# Altium project as14120_x31.PrjPCB (part 3 of 3)

## Sheet as14120_x31_adc.SchDoc
size A3; PageSetup: Record=PageOptions|CenterHorizontal=True|CenterVertical=True|PrintScale=1.11|XCorrection=1.00|YCorrection=1.00|PrintKind=0|BorderSize=5000000|LeftOffset=0|BottomOffset=0|Orientation=2|PaperLength=1000|PaperWidth=1000|Scale=100|PaperSource=7|PrintQuality=-4|MediaType=1|DitherType=10|PaperKind=A4 (210 x 297 мм)|PrintScaleMode=1
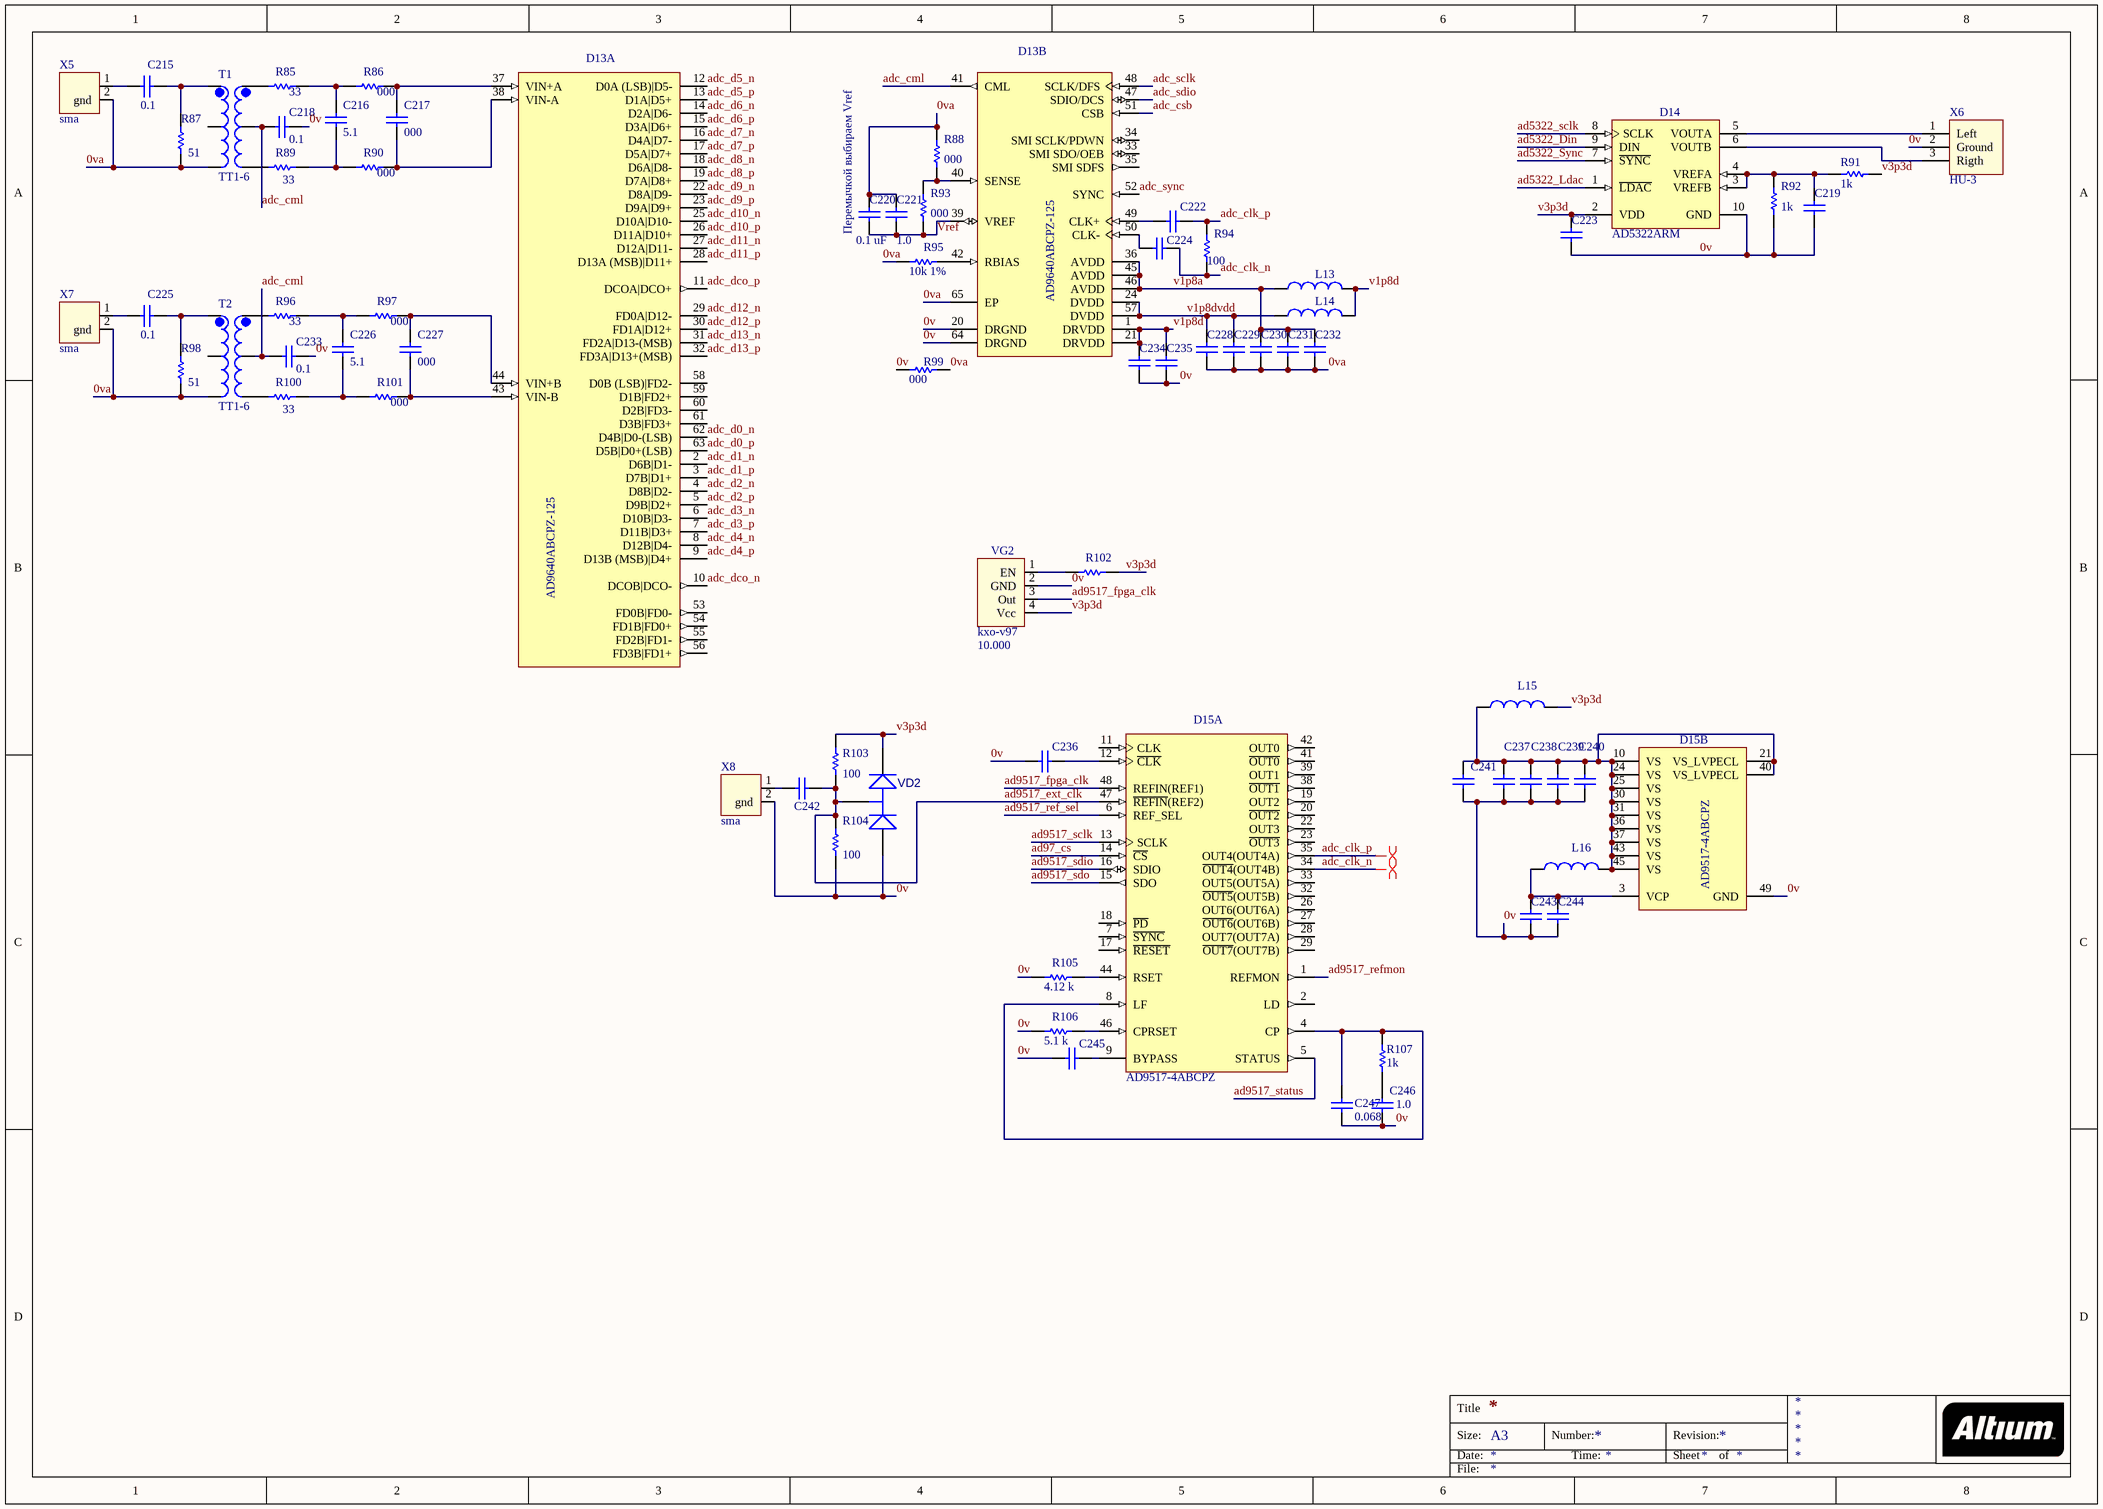
[diagram p7: as14120_x31_adc.SchDoc]

### Parts
C215  value 0.1  [CAPC0402(1005)60_M]  (hidden comment: CAP 1uF 10V 0402(1005))
C216  value 5.1  [CAPC0805(2012)100_N]  (hidden comment: CAP_0805)
C217  value 000  [CAPC0805(2012)100_N]  (hidden comment: CAP_0805)
C218  value 0.1  [CAPC0402(1005)60_M]  (hidden comment: CAP 1uF 10V 0402(1005))
C219  CAP 1uF 10V 0402(1005)  [CAPC0402(1005)60_M]  (value not drawn)
C220  value 0.1 uF  [CAPC0402(1005)60_M]  (hidden comment: CAP 1uF 10V 0402(1005))
C221  value 1.0  [CAPC0402(1005)60_M]  (hidden comment: CAP 1uF 10V 0402(1005))
C222  CAP 1uF 10V 0402(1005)  [CAPC0402(1005)60_M]  (value not drawn)
C223  CAP 1uF 10V 0402(1005)  [CAPC0402(1005)60_M]  (value not drawn)
C224  CAP 1uF 10V 0402(1005)  [CAPC0402(1005)60_M]  (value not drawn)
C225  value 0.1  [CAPC0402(1005)60_M]  (hidden comment: CAP 1uF 10V 0402(1005))
C226  value 5.1  [CAPC0805(2012)100_N]  (hidden comment: CAP_0805)
C227  value 000  [CAPC0805(2012)100_N]  (hidden comment: CAP_0805)
C228  CAP 1uF 10V 0402(1005)  [CAPC0402(1005)60_M]  (value not drawn)
C229  CAP 1uF 10V 0402(1005)  [CAPC0402(1005)60_M]  (value not drawn)
C230  CAP 1uF 10V 0402(1005)  [CAPC0402(1005)60_M]  (value not drawn)
C231  CAP 1uF 10V 0402(1005)  [CAPC0402(1005)60_M]  (value not drawn)
C232  CAP 1uF 10V 0402(1005)  [CAPC0402(1005)60_M]  (value not drawn)
C233  value 0.1  [CAPC0402(1005)60_M]  (hidden comment: CAP 1uF 10V 0402(1005))
C234  CAP 1uF 10V 0402(1005)  [CAPC0402(1005)60_M]  (value not drawn)
C235  CAP 1uF 10V 0402(1005)  [CAPC0402(1005)60_M]  (value not drawn)
C236  CAP 1uF 10V 0402(1005)  [CAPC0402(1005)60_M]  (value not drawn)
C237  CAP 1uF 10V 0402(1005)  [CAPC0402(1005)60_M]  (value not drawn)
C238  CAP 1uF 10V 0402(1005)  [CAPC0402(1005)60_M]  (value not drawn)
C239  CAP 1uF 10V 0402(1005)  [CAPC0402(1005)60_M]  (value not drawn)
C240  CAP 1uF 10V 0402(1005)  [CAPC0402(1005)60_M]  (value not drawn)
C241  CAP 1uF 10V 0402(1005)  [CAPC0402(1005)60_M]  (value not drawn)
C242  CAP 1uF 10V 0402(1005)  [CAPC0402(1005)60_M]  (value not drawn)
C243  CAP 1uF 10V 0402(1005)  [CAPC0402(1005)60_M]  (value not drawn)
C244  CAP 1uF 10V 0402(1005)  [CAPC0402(1005)60_M]  (value not drawn)
C245  CAP 1uF 10V 0402(1005)  [CAPC0402(1005)60_M]  (value not drawn)
C246  value 1.0  [CAPC0805(2012)100_N]  (hidden comment: CAP_0805)
C247  value 0.068  [CAPC0805(2012)100_N]  (hidden comment: CAP_0805)
D13  AD9640ABCPZ-125  [CP-64-6_N]  (parts A,B of 2)
D14  AD5322ARM  [RM-10_L]
D15  AD9517-4ABCPZ  [ADI-CP-48-8_L]  (parts A,B of 2)
L13  BLM21PG300SN1D  [CAPC0805(2012)100_N]  (value not drawn)
L14  BLM21PG300SN1D  [CAPC0805(2012)100_N]  (value not drawn)
L15  BLM21PG300SN1D  [CAPC0805(2012)100_N]  (value not drawn)
L16  BLM21PG300SN1D  [CAPC0805(2012)100_N]  (value not drawn)
R85  value 33  [RESC0805(2012)_L]  (hidden comment: 1K 1% 0805(2012))
R86  value 000  [RESC0805(2012)_L]  (hidden comment: 1K 1% 0805(2012))
R87  value 51  [RESC0805(2012)_L]  (hidden comment: 1K 1% 0805(2012))
R88  value 000  [RESC0603(1608)_L]  (hidden comment: 1K 5% 0603(1608))
R89  value 33  [RESC0805(2012)_L]  (hidden comment: 1K 1% 0805(2012))
R90  value 000  [RESC0805(2012)_L]  (hidden comment: 1K 1% 0805(2012))
R91  1k  [RESC0603(1608)_L]
R92  1k  [RESC0603(1608)_L]
R93  value 000  [RESC0603(1608)_L]  (hidden comment: 1K 5% 0603(1608))
R94  100  [RESC0805(2012)_L]
R95  10k 1%  [RESC0805(2012)_L]
R96  value 33  [RESC0805(2012)_L]  (hidden comment: 1K 1% 0805(2012))
R97  value 000  [RESC0805(2012)_L]  (hidden comment: 1K 1% 0805(2012))
R98  value 51  [RESC0805(2012)_L]  (hidden comment: 1K 1% 0805(2012))
R99  000  [RESC0603(1608)_L]
R100  value 33  [RESC0805(2012)_L]  (hidden comment: 1K 1% 0805(2012))
R101  value 000  [RESC0805(2012)_L]  (hidden comment: 1K 1% 0805(2012))
R102  1K 5% 0603(1608)  [RESC0603(1608)_L]  (value not drawn)
R103  value 100  [RESC0805(2012)_L]  (hidden comment: 1K 1% 0805(2012))
R104  value 100  [RESC0805(2012)_L]  (hidden comment: 1K 1% 0805(2012))
R105  value 4.12 k  [RESC0805(2012)_L]  (hidden comment: 1K 1% 0805(2012))
R106  value 5.1 k  [RESC0805(2012)_L]  (hidden comment: 1K 1% 0805(2012))
R107  value 1k  [RESC0805(2012)_L]  (hidden comment: 1K 1% 0805(2012))
T1  TT1-6  [TT!-6-KK81]
T2  TT1-6  [TT!-6-KK81]
VD2  BAV99  [SO-G3/X.9]  (value not drawn)
VG2  kxo-v97  value 10.000  [kxo-v97]
X5  sma  [sma]
X6  HU-3  [HU-3]
X7  sma  [sma]
X8  sma  [sma]

### Nets
0v: C218.2 C219.1 C223.1 C233.2 C234.1 C235.1 C236.1 C237.1 C238.1 C239.1 C240.1 C241.1 C243.1 C244.1 C245.1 C246.1 C247.1 D13.20(DRGND) D13.64(DRGND) D14.10(GND) D15.49(GND) R92.2 R99.1 R104.1 R105.2 R106.2 VD2.3(A) VG2.2(GND) X6.2(Ground) X8.2(gnd)
0va: C220.2 C221.2 C228.1 C229.1 C230.1 C231.1 C232.1 D13.65(EP) R87.1 R88.1 R95.2 R98.1 R99.2 T1.6 T2.6 X5.2(gnd) X7.2(gnd)
ad97_cs: D15.14(~{CS})
AD5322_DIN: D14.9(DIN)
AD5322_LDAC: D14.1(~{LDAC})
AD5322_SCLK: D14.8(SCLK)
AD5322_SYNC: D14.7(~{SYNC})
ad9517_ext_clk: C242.2 D15.47(~{REFIN}(REF2)) R103.1 R104.2 VD2.1(C)
ad9517_fpga_clk: D15.48(REFIN(REF1)) VG2.3(Out)
ad9517_ref_sel: D15.6(REF_SEL)
ad9517_refmon: D15.1(REFMON)
ad9517_sclk: D15.13(SCLK)
ad9517_sdio: D15.16(SDIO)
ad9517_sdo: D15.15(SDO)
ad9517_status: D15.5(STATUS)
adc_clk_n: C224.1 D15.34(~{OUT4}(OUT4B)) R94.1
adc_clk_p: C222.1 D15.35(OUT4(OUT4A)) R94.2
adc_cml: C218.1 C233.1 D13.41(CML) T1.2 T2.2
adc_csb: D13.51(CSB)
adc_d0_n: D13.62(D4B|D0-(LSB))
adc_d0_p: D13.63(D5B|D0+(LSB))
adc_d1_n: D13.2(D6B|D1-)
adc_d1_p: D13.3(D7B|D1+)
adc_d2_n: D13.4(D8B|D2-)
adc_d2_p: D13.5(D9B|D2+)
adc_d3_n: D13.6(D10B|D3-)
adc_d3_p: D13.7(D11B|D3+)
adc_d4_n: D13.8(D12B|D4-)
adc_d4_p: D13.9(D13B_(MSB)|D4+)
adc_d5_n: D13.12(D0A_(LSB)|D5-)
adc_d5_p: D13.13(D1A|D5+)
adc_d6_n: D13.14(D2A|D6-)
adc_d6_p: D13.15(D3A|D6+)
adc_d7_n: D13.16(D4A|D7-)
adc_d7_p: D13.17(D5A|D7+)
adc_d8_n: D13.18(D6A|D8-)
adc_d8_p: D13.19(D7A|D8+)
adc_d9_n: D13.22(D8A|D9-)
adc_d9_p: D13.23(D9A|D9+)
adc_d10_n: D13.25(D10A|D10-)
adc_d10_p: D13.26(D11A|D10+)
adc_d11_n: D13.27(D12A|D11-)
adc_d11_p: D13.28(D13A_(MSB)|D11+)
adc_d12_n: D13.29(FD0A|D12-)
adc_d12_p: D13.30(FD1A|D12+)
adc_d13_n: D13.31(FD2A|D13-(MSB))
adc_d13_p: D13.32(FD3A|D13+(MSB))
adc_dco_n: D13.10(DCOB|DCO-)
adc_dco_p: D13.11(DCOA|DCO+)
adc_sclk: D13.48(SCLK/DFS)
adc_sdio: D13.47(SDIO/DCS)
adc_sync: D13.52(SYNC)
v1p8a: C230.2 C231.2 C232.2 D13.36(AVDD) D13.45(AVDD) D13.46(AVDD) L13.1
v1p8d: C234.2 C235.2 D13.1(DRVDD) D13.21(DRVDD) L13.2 L14.2
v1p8dvdd: C228.2 C229.2 D13.24(DVDD) D13.57(DVDD) L14.1
v3p3d: C223.2 D14.2(VDD) L15.2 R91.2 R102.1 R103.2 VD2.2(K) VG2.4(Vcc)
Vref: C220.1 C221.1 D13.39(VREF) R93.2
NetC215_1: C215.1 X5.1
NetC215_2: C215.2 R87.2 T1.4
NetC216_1: C216.1 R89.1 R90.2
NetC216_2: C216.2 R85.1 R86.2
NetC217_1: C217.1 D13.38(VIN-A) R90.1
NetC217_2: C217.2 D13.37(VIN+A) R86.1
NetC219_2: C219.2 D14.3(VREFB) D14.4(VREFA) R91.1 R92.1
NetC222_2: C222.2 D13.49(CLK+)
NetC224_2: C224.2 D13.50(CLK-)
NetC225_1: C225.1 X7.1
NetC225_2: C225.2 R98.2 T2.4
NetC226_1: C226.1 R100.1 R101.2
NetC226_2: C226.2 R96.1 R97.2
NetC227_1: C227.1 D13.43(VIN-B) R101.1
NetC227_2: C227.2 D13.44(VIN+B) R97.1
NetC236_2: C236.2 D15.12(~{CLK})
NetC237_2: C237.2 C238.2 C239.2 C240.2 C241.2 D15.10(VS) D15.21(VS_LVPECL) D15.24(VS) D15.25(VS) D15.30(VS) D15.31(VS) D15.36(VS) D15.37(VS) D15.40(VS_LVPECL) D15.43(VS) D15.45(VS) L15.1 L16.2
NetC242_1: C242.1 X8.1
NetC243_2: C243.2 C244.2 D15.3(VCP) L16.1
NetC245_2: C245.2 D15.9(BYPASS)
NetC246_2: C246.2 R107.2
NetC247_2: C247.2 D15.4(CP) D15.8(LF) R107.1
NetD13_40: D13.40(SENSE) R88.2 R93.1
NetD13_42: D13.42(RBIAS) R95.1
NetD14_5: D14.5(VOUTA) X6.1(Left)
NetD14_6: D14.6(VOUTB) X6.3(Rigth)
NetD15_44: D15.44(RSET) R105.1
NetD15_46: D15.46(CPRSET) R106.1
NetR85_2: R85.2 T1.3
NetR89_2: R89.2 T1.1
NetR96_2: R96.2 T2.3
NetR100_2: R100.2 T2.1
NetR102_2: R102.2 VG2.1(EN)

Not connected (* = marked no-connect by the designer): D13 33(SMI_SDO/OEB) 34(SMI_SCLK/PDWN) 35(SMI_SDFS) 53(FD0B|FD0-) 54(FD1B|FD0+) 55(FD2B|FD1-) 56(FD3B|FD1+) 58(D0B_(LSB)|FD2-) 59(D1B|FD2+) 60(D2B|FD3-) 61(D3B|FD3+); D15 2(LD) 7(~{SYNC}) 11(CLK) 17(~{RESET}) 18(~{PD}) 19(OUT2) 20(~{OUT2}) 22(OUT3) 23(~{OUT3}) 26(OUT6(OUT6A)) 27(~{OUT6}(OUT6B)) 28(OUT7(OUT7A)) 29(~{OUT7}(OUT7B)) 32(~{OUT5}(OUT5B)) 33(OUT5(OUT5A)) 38(~{OUT1}) 39(OUT1) 41(~{OUT0}) 42(OUT0); T1 5; T2 5

### Layout directives
differential pair: adc_clk_n, adc_clk_p

### Notes on the sheet
- (near C220) Перемычкой выбираем Vref
- Title
- Size:
- Date:
- A3
- Number:
- Time:
- Revision:
- Sheet
- of
- File:

### Library data of the parts
C215 C218 C220 C221 C225 C233 = CAP_0402: as C1-C38 on sheet as14120_x31_ddr; Tolerance: ±20%; Max Thickness: 0.6 mm; Rated Voltage: 10 V; Technology: SMT
C219 C222-C224 C228-C232 C234-C241 C243-C245 = CAP_0402: CAP 1uF 10V ±20% 0402 (1005 Metric) Thickness 0.6mm SMD; Case-Metric: 1005; Case-EIA: 0402; Value: 0.1 uF; Tolerance: ±20%; Max Thickness: 0.6 mm; Rated Voltage: 10 V; Technology: SMT
C242 = CAP_0402: CAP 1uF 10V ±20% 0402 (1005 Metric) Thickness 0.6mm SMD; Case-Metric: 1005; Case-EIA: 0402; Value: 0.01 uF; Tolerance: ±20%; Max Thickness: 0.6 mm; Rated Voltage: 10 V; Technology: SMT
D13 = AD9640ABCPZ-125: Dual 14-Bit Analog-to-Digital Converter with Parallel Interface, 1.8 V, 125MSPS, -40 to +85 degC, CP-64-6, Pb-Free, Tray; Part Number: AD9640-125; Manufacturer: Analog Devices; Resolution (Bits): 14; Channels: 2; Throughput Rate (SPS): 125M; Interface: Par; DatasheetVersion: Rev.B; PackageVersion: 041509-A; PackageReference: CP-64-6; PackageDescription: 64-Lead Lead Frame Chip Scale Package [LFCSP_VQ] 9 x 9 mm Body, Very Thin Quad; RoHS: Y; Packing: Tray; Mounting Technology: Surface Mount; Code_JEDEC: MO-220-VMMD-4; ComponentLink1Description: Manufacturer URL; ComponentLink1URL: http://www.analog.com/en/index.html; ComponentLink2Description: Datasheet; ComponentLink2URL: http://www.analog.com/static/imported-files/data_sheets/AD9640.pdf; ComponentLink3Description: Package Specification; ComponentLink3URL: http://www.analog.com/static/imported-files/packages/PKG_PDF/LFCSP(CP)/CP_64_6.pdf; ComponentLink4Description: Product URL; ComponentLink4URL: http://www.analog.com/en/analog-to-digital-converters/ad-converters/ad9640/products/product.html
D14 = AD5322ARM: Dual 12-Bit Rail-to-Rail Output Digital-to-Analog Converter, 2.5 to 5.5 V, -40 to +105 degC, RM-10, Tube; ADI Part Number: AD5322; Manufacturer: Analog Devices; # DAC Outputs: 2; Max V+: 5.5V; Op Pwr Diss: 2.5mW; Resolution (Bits): 12; Settling Time: 8µs; Single Supply: Yes; DatasheetVersion: Rev.D; PackageVersion: May-2005; PackageReference: RM-10; PackageDescription: 10-Lead Mini Small Outline Package [MSOP]; Packing: Tube; RoHS: N; Mounting Technology: Surface Mount; ComponentLink1Description: Manufacturer URL; ComponentLink1URL: http://www.analog.com/en/index.html; ComponentLink2Description: Datasheet; ComponentLink2URL: http://www.analog.com/static/imported-files/data_sheets/AD5302_5312_5322.pdf; ComponentLink3Description: Package Specification; ComponentLink3URL: http://www.analog.com/static/imported-files/packages/PKG_PDF/MSOP%28RM%29/RM_10.pdf; ComponentLink4Description: URL Link1; ComponentLink4URL: Product URL:http://www.analog.com/en/digital-to-analog-converters/da-converters/ad5322/products/product.html
D15 = AD9517-4ABCPZ: 12-Output Clock Generator with Integrated 2.5 GHz VCO, 1800 MHz Max f-out, CP-48-8, Pb-Free, 260 Tray; Product Description: Multi-Output Clock Generator; +Supply Voltage (V): 3.3; Inputs: 2; Outputs: 12; Dividers: 4; On-Chip VCO or DCO: Yes; Max f-out (MHz): 1800; Output Logic: CMOS; LVDS; LVPECL; DatasheetVersion: Rev.D; PackageVersion: 02-23-2010-C; PackageReference: CP-48-8; PackageDescription: 48-Lead Lead Frame Chip Scale Package [LFCSP_VQ]; Code_JEDEC: MO-220-VKKD-2; ComponentLink1Description: Manufacturer URL; ComponentLink1URL: www.analog.com; ComponentLink2Description: Datasheet; ComponentLink2URL: http://www.analog.com/static/imported-files/data_sheets/AD9517-4.pdf; ComponentLink3Description: Package Specification; ComponentLink3URL: http://www.analog.com/static/imported-files/packages/PKG_PDF/LFCSP(CP)/CP_48_8.pdf
L13-L16 = Ferrite_beat
R85-R87 R89 R90 R94-R98 R100 R101 R103-R107 = RES_0805: as R13-R20 on sheet as14120_x31_ddr; Tolerance: 1 %; Power: 0.125 W; Technology: SMT
  R94: Value: 100
  R95: Value: 10k 1%
R88 R91-R93 R99 = RES_0603: 1K 0.1W 5% 0603 (1608 Metric)  SMD; Case-Metric: 1608; Case-EIA: 0603; Tolerance: 5 %; Power: 0.1 W; Technology: SMT
  R91 R92: Value: 1k
  R99: Value: 000
R102 = RES_0603: 1K 0.1W 5% 0603 (1608 Metric)  SMD; Case-EIA: 0603; Case-Metric: 1608; Value: 1000.00 Ohm; Technology: SMT; Tolerance: 5 %; Power: 0.1 W
T1 T2 = TT1-6-KK81
VD2 = BAV99: SOT23 Silicon Planar High-Speed Switching Series Diode Pair; Value: {Value}; OriginalName: BAV99

## Nets that join several sheets
0v: as14120_x31_usb (69 pins), as14120_x31_fpga_ttl (9 pins), as14120_x31_fpga_power_conf (303 pins), as14120_x31_fpga_ddr (36 pins), as14120_x31_fpga_cypress (D4.P23 R22.2), as14120_x31_ddr (114 pins), as14120_x31_adc (30 pins)
ad97_cs: as14120_x31_fpga_cypress (D4.J27), as14120_x31_adc (D15.14)
AD5322_DIN: as14120_x31_fpga_cypress (D4.V25), as14120_x31_adc (D14.9)
AD5322_LDAC: as14120_x31_fpga_cypress (D4.T24), as14120_x31_adc (D14.1)
AD5322_SCLK: as14120_x31_fpga_cypress (D4.V26), as14120_x31_adc (D14.8)
AD5322_SYNC: as14120_x31_fpga_cypress (D4.U26), as14120_x31_adc (D14.7)
ad9517_fpga_clk: as14120_x31_fpga_cypress (D4.P22), as14120_x31_adc (D15.48 VG2.3)
ad9517_ref_sel: as14120_x31_fpga_cypress (D4.K25), as14120_x31_adc (D15.6)
ad9517_refmon: as14120_x31_fpga_cypress (D4.L25), as14120_x31_adc (D15.1)
ad9517_sclk: as14120_x31_fpga_cypress (D4.K27), as14120_x31_adc (D15.13)
ad9517_sdio: as14120_x31_fpga_cypress (D4.L26), as14120_x31_adc (D15.16)
ad9517_sdo: as14120_x31_fpga_cypress (D4.K26), as14120_x31_adc (D15.15)
ad9517_status: as14120_x31_fpga_cypress (D4.J25), as14120_x31_adc (D15.5)
adc_csb: as14120_x31_fpga_cypress (D4.M28), as14120_x31_adc (D13.51)
adc_d0_n: as14120_x31_fpga_cypress (D4.A29), as14120_x31_adc (D13.62)
adc_d0_p: as14120_x31_fpga_cypress (D4.B28), as14120_x31_adc (D13.63)
adc_d1_n: as14120_x31_fpga_cypress (D4.B29), as14120_x31_adc (D13.2)
adc_d1_p: as14120_x31_fpga_cypress (D4.C29), as14120_x31_adc (D13.3)
adc_d2_n: as14120_x31_fpga_cypress (D4.C30), as14120_x31_adc (D13.4)
adc_d2_p: as14120_x31_fpga_cypress (D4.D30), as14120_x31_adc (D13.5)
adc_d3_n: as14120_x31_fpga_cypress (D4.D29), as14120_x31_adc (D13.6)
adc_d3_p: as14120_x31_fpga_cypress (D4.D28), as14120_x31_adc (D13.7)
adc_d4_n: as14120_x31_fpga_cypress (D4.D27), as14120_x31_adc (D13.8)
adc_d4_p: as14120_x31_fpga_cypress (D4.E27), as14120_x31_adc (D13.9)
adc_d5_n: as14120_x31_fpga_cypress (D4.E30), as14120_x31_adc (D13.12)
adc_d5_p: as14120_x31_fpga_cypress (D4.F30), as14120_x31_adc (D13.13)
adc_d6_n: as14120_x31_fpga_cypress (D4.F29), as14120_x31_adc (D13.14)
adc_d6_p: as14120_x31_fpga_cypress (D4.G29), as14120_x31_adc (D13.15)
adc_d7_n: as14120_x31_fpga_cypress (D4.G28), as14120_x31_adc (D13.16)
adc_d7_p: as14120_x31_fpga_cypress (D4.G27), as14120_x31_adc (D13.17)
adc_d8_n: as14120_x31_fpga_cypress (D4.H30), as14120_x31_adc (D13.18)
adc_d8_p: as14120_x31_fpga_cypress (D4.H29), as14120_x31_adc (D13.19)
adc_d9_n: as14120_x31_fpga_cypress (D4.J29), as14120_x31_adc (D13.22)
adc_d9_p: as14120_x31_fpga_cypress (D4.J28), as14120_x31_adc (D13.23)
adc_d10_n: as14120_x31_fpga_cypress (D4.J30), as14120_x31_adc (D13.25)
adc_d10_p: as14120_x31_fpga_cypress (D4.K30), as14120_x31_adc (D13.26)
adc_d11_n: as14120_x31_fpga_cypress (D4.L30), as14120_x31_adc (D13.27)
adc_d11_p: as14120_x31_fpga_cypress (D4.L29), as14120_x31_adc (D13.28)
adc_d12_n: as14120_x31_fpga_cypress (D4.N30), as14120_x31_adc (D13.29)
adc_d12_p: as14120_x31_fpga_cypress (D4.M29), as14120_x31_adc (D13.30)
adc_d13_n: as14120_x31_fpga_cypress (D4.N29), as14120_x31_adc (D13.31)
adc_d13_p: as14120_x31_fpga_cypress (D4.P28), as14120_x31_adc (D13.32)
adc_dco_n: as14120_x31_fpga_cypress (D4.E28), as14120_x31_adc (D13.10)
adc_dco_p: as14120_x31_fpga_cypress (D4.F28), as14120_x31_adc (D13.11)
adc_sclk: as14120_x31_fpga_cypress (D4.K28), as14120_x31_adc (D13.48)
adc_sdio: as14120_x31_fpga_cypress (D4.L28), as14120_x31_adc (D13.47)
adc_sync: as14120_x31_fpga_cypress (D4.M27), as14120_x31_adc (D13.52)
cy_ctrl0: as14120_x31_usb (R69.3), as14120_x31_fpga_cypress (D4.AG29)
cy_ctrl1: as14120_x31_usb (R69.2), as14120_x31_fpga_cypress (D4.AF29)
cy_ctrl2: as14120_x31_usb (R64.1), as14120_x31_fpga_cypress (D4.AD29)
cy_ctrl3: as14120_x31_usb (R71.4), as14120_x31_fpga_cypress (D4.AC27)
cy_ctrl4: as14120_x31_usb (R65.1), as14120_x31_fpga_cypress (D4.AF26)
cy_ctrl5: as14120_x31_usb (R67.4), as14120_x31_fpga_cypress (D4.AE25)
cy_ctrl6: as14120_x31_usb (R69.1), as14120_x31_fpga_cypress (D4.AF30)
cy_ctrl7: as14120_x31_usb (R71.1), as14120_x31_fpga_cypress (D4.AF28)
cy_ctrl8: as14120_x31_usb (R64.4), as14120_x31_fpga_cypress (D4.AA26)
cy_ctrl9: as14120_x31_usb (R64.2), as14120_x31_fpga_cypress (D4.AA25)
cy_ctrl10: as14120_x31_usb (R70.4), as14120_x31_fpga_cypress (D4.AE30)
cy_ctrl11: as14120_x31_usb (R66.3), as14120_x31_fpga_cypress (D4.Y27)
cy_ctrl12: as14120_x31_usb (R66.2), as14120_x31_fpga_cypress (D4.Y26)
cy_dq0: as14120_x31_usb (R74.3), as14120_x31_fpga_cypress (D4.AF24)
cy_dq1: as14120_x31_usb (R67.3), as14120_x31_fpga_cypress (D4.AF25)
cy_dq2: as14120_x31_usb (R67.1), as14120_x31_fpga_cypress (D4.AD24)
cy_dq3: as14120_x31_usb (R74.2), as14120_x31_fpga_cypress (D4.AH27)
cy_dq4: as14120_x31_usb (R65.3), as14120_x31_fpga_cypress (D4.AE26)
cy_dq5: as14120_x31_usb (R67.2), as14120_x31_fpga_cypress (D4.AC24)
cy_dq6: as14120_x31_usb (R74.1), as14120_x31_fpga_cypress (D4.AJ28)
cy_dq7: as14120_x31_usb (R65.2), as14120_x31_fpga_cypress (D4.AD25)
cy_dq8: as14120_x31_usb (R58.4), as14120_x31_fpga_cypress (D4.AG27)
cy_dq9: as14120_x31_usb (R71.2), as14120_x31_fpga_cypress (D4.AC26)
cy_dq10: as14120_x31_usb (R58.3), as14120_x31_fpga_cypress (D4.AJ29)
cy_dq11: as14120_x31_usb (R58.1), as14120_x31_fpga_cypress (D4.AJ30)
cy_dq12: as14120_x31_usb (R58.2), as14120_x31_fpga_cypress (D4.AH29)
cy_dq13: as14120_x31_usb (R69.4), as14120_x31_fpga_cypress (D4.AH30)
cy_dq14: as14120_x31_usb (R71.3), as14120_x31_fpga_cypress (D4.AD27)
cy_dq15: as14120_x31_usb (R65.4), as14120_x31_fpga_cypress (D4.AG28)
cy_dq16: as14120_x31_usb (R70.3), as14120_x31_fpga_cypress (D4.AD28)
cy_dq17: as14120_x31_usb (R66.4), as14120_x31_fpga_cypress (D4.W27)
cy_dq18: as14120_x31_usb (R70.2), as14120_x31_fpga_cypress (D4.AD30)
cy_dq19: as14120_x31_usb (R70.1), as14120_x31_fpga_cypress (D4.AC30)
cy_dq20: as14120_x31_usb (R72.1), as14120_x31_fpga_cypress (D4.V27)
cy_dq21: as14120_x31_usb (R63.4), as14120_x31_fpga_cypress (D4.AC29)
cy_dq22: as14120_x31_usb (R63.3), as14120_x31_fpga_cypress (D4.AB29)
cy_dq23: as14120_x31_usb (R72.3), as14120_x31_fpga_cypress (D4.V29)
cy_dq24: as14120_x31_usb (R72.2), as14120_x31_fpga_cypress (D4.U27)
cy_dq25: as14120_x31_usb (R63.2), as14120_x31_fpga_cypress (D4.AA30)
cy_dq26: as14120_x31_usb (R72.4), as14120_x31_fpga_cypress (D4.T29)
cy_dq27: as14120_x31_usb (R63.1), as14120_x31_fpga_cypress (D4.Y30)
cy_dq28: as14120_x31_usb (R66.1), as14120_x31_fpga_cypress (D4.AA28)
cy_dq29: as14120_x31_usb (R73.3), as14120_x31_fpga_cypress (D4.W30)
cy_dq30: as14120_x31_usb (R74.4), as14120_x31_fpga_cypress (D4.AE23)
cy_dq31: as14120_x31_usb (R73.4), as14120_x31_fpga_cypress (D4.W29)
cy_pclk: as14120_x31_usb (R64.3), as14120_x31_fpga_cypress (D4.AB26)
ddr0_a0: as14120_x31_fpga_ddr (D4.AJ12), as14120_x31_ddr (D1.N3 R3.6)
ddr0_a1: as14120_x31_fpga_ddr (D4.AK12), as14120_x31_ddr (D1.P7 R11.6)
ddr0_a2: as14120_x31_fpga_ddr (D4.AH11), as14120_x31_ddr (D1.P3 R11.5)
ddr0_a3: as14120_x31_fpga_ddr (D4.AH12), as14120_x31_ddr (D1.N2 R3.7)
ddr0_a4: as14120_x31_fpga_ddr (D4.AG13), as14120_x31_ddr (D1.P8 R6.6)
ddr0_a5: as14120_x31_fpga_ddr (D4.AG14), as14120_x31_ddr (D1.P2 R9.6)
ddr0_a6: as14120_x31_fpga_ddr (D4.AK10), as14120_x31_ddr (D1.R8 R6.7)
ddr0_a7: as14120_x31_fpga_ddr (D4.AK11), as14120_x31_ddr (D1.R2 R9.5)
ddr0_a8: as14120_x31_fpga_ddr (D4.AF11), as14120_x31_ddr (D1.T8 R6.5)
ddr0_a9: as14120_x31_fpga_ddr (D4.AG11), as14120_x31_ddr (D1.R3 R9.7)
ddr0_a10: as14120_x31_fpga_ddr (D4.AJ8), as14120_x31_ddr (D1.L7 R1.6)
ddr0_a11: as14120_x31_fpga_ddr (D4.AK8), as14120_x31_ddr (D1.R7 R11.8)
ddr0_a12: as14120_x31_fpga_ddr (D4.AJ7), as14120_x31_ddr (D1.N7 R1.5)
ddr0_a13: as14120_x31_fpga_ddr (D4.AK7), as14120_x31_ddr (D1.T3 R9.8)
ddr0_a14: as14120_x31_fpga_ddr (D4.AF13), as14120_x31_ddr (D1.T7 R11.7)
ddr0_ba0: as14120_x31_fpga_ddr (D4.AH9), as14120_x31_ddr (D1.M2 R3.5)
ddr0_ba1: as14120_x31_fpga_ddr (D4.AH10), as14120_x31_ddr (D1.N8 R6.8)
ddr0_ba2: as14120_x31_fpga_ddr (D4.AJ10), as14120_x31_ddr (D1.M3 R3.8)
ddr0_cas: as14120_x31_fpga_ddr (D4.AF9), as14120_x31_ddr (D1.K3 R4.6)
ddr0_ck_n: as14120_x31_fpga_ddr (D4.AA14), as14120_x31_ddr (D1.K7 R1.7)
ddr0_ck_p: as14120_x31_fpga_ddr (D4.Y13), as14120_x31_ddr (D1.J7 R1.8)
ddr0_cke: as14120_x31_fpga_ddr (D4.AK18), as14120_x31_ddr (D1.K9 R15.2)
ddr0_cs: as14120_x31_fpga_ddr (D4.Y12), as14120_x31_ddr (D1.L2 R4.8)
ddr0_dm0: as14120_x31_fpga_ddr (D4.AE15), as14120_x31_ddr (D1.E7)
ddr0_dm1: as14120_x31_fpga_ddr (D4.AH19), as14120_x31_ddr (D1.D3)
ddr0_dq0: as14120_x31_fpga_ddr (D4.AF15), as14120_x31_ddr (D1.E3)
ddr0_dq1: as14120_x31_fpga_ddr (D4.AE16), as14120_x31_ddr (D1.F7)
ddr0_dq2: as14120_x31_fpga_ddr (D4.AJ14), as14120_x31_ddr (D1.F2)
ddr0_dq3: as14120_x31_fpga_ddr (D4.AH15), as14120_x31_ddr (D1.F8)
ddr0_dq4: as14120_x31_fpga_ddr (D4.AE17), as14120_x31_ddr (D1.H3)
ddr0_dq5: as14120_x31_fpga_ddr (D4.AD17), as14120_x31_ddr (D1.H8)
ddr0_dq6: as14120_x31_fpga_ddr (D4.AJ15), as14120_x31_ddr (D1.G2)
ddr0_dq7: as14120_x31_fpga_ddr (D4.AF14), as14120_x31_ddr (D1.H7)
ddr0_dq8: as14120_x31_fpga_ddr (D4.AK17), as14120_x31_ddr (D1.D7)
ddr0_dq9: as14120_x31_fpga_ddr (D4.AK16), as14120_x31_ddr (D1.C3)
ddr0_dq10: as14120_x31_fpga_ddr (D4.AG17), as14120_x31_ddr (D1.C8)
ddr0_dq11: as14120_x31_fpga_ddr (D4.AJ18), as14120_x31_ddr (D1.C2)
ddr0_dq12: as14120_x31_fpga_ddr (D4.AG16), as14120_x31_ddr (D1.A7)
ddr0_dq13: as14120_x31_fpga_ddr (D4.AF16), as14120_x31_ddr (D1.A2)
ddr0_dq14: as14120_x31_fpga_ddr (D4.AJ19), as14120_x31_ddr (D1.B8)
ddr0_dq15: as14120_x31_fpga_ddr (D4.AH20), as14120_x31_ddr (D1.A3)
ddr0_dqs0_n: as14120_x31_fpga_ddr (D4.AA16), as14120_x31_ddr (D1.G3)
ddr0_dqs0_p: as14120_x31_fpga_ddr (D4.Y16), as14120_x31_ddr (D1.F3)
ddr0_dqs1_n: as14120_x31_fpga_ddr (D4.Y18), as14120_x31_ddr (D1.B7)
ddr0_dqs1_p: as14120_x31_fpga_ddr (D4.Y17), as14120_x31_ddr (D1.C7)
ddr0_odt: as14120_x31_fpga_ddr (D4.AH14), as14120_x31_ddr (D1.K1)
ddr0_ras: as14120_x31_fpga_ddr (D4.AG9), as14120_x31_ddr (D1.J3 R4.5)
ddr0_reset_n: as14120_x31_fpga_ddr (D4.AK21), as14120_x31_ddr (D1.T2 R17.2)
ddr0_we: as14120_x31_fpga_ddr (D4.AK5), as14120_x31_ddr (D1.L3 R4.7)
ddr1_a0: as14120_x31_fpga_ddr (D4.B11), as14120_x31_ddr (D2.N3 R7.7)
ddr1_a1: as14120_x31_fpga_ddr (D4.A11), as14120_x31_ddr (D2.P7 R12.8)
ddr1_a2: as14120_x31_fpga_ddr (D4.F9), as14120_x31_ddr (D2.P3 R8.5)
ddr1_a3: as14120_x31_fpga_ddr (D4.E10), as14120_x31_ddr (D2.N2 R10.8)
ddr1_a4: as14120_x31_fpga_ddr (D4.F16), as14120_x31_ddr (D2.P8 R12.7)
ddr1_a5: as14120_x31_fpga_ddr (D4.E16), as14120_x31_ddr (D2.P2 R10.5)
ddr1_a6: as14120_x31_fpga_ddr (D4.D9), as14120_x31_ddr (D2.R8 R12.5)
ddr1_a7: as14120_x31_fpga_ddr (D4.C10), as14120_x31_ddr (D2.R2 R10.6)
ddr1_a8: as14120_x31_fpga_ddr (D4.E12), as14120_x31_ddr (D2.T8 R8.8)
ddr1_a9: as14120_x31_fpga_ddr (D4.D13), as14120_x31_ddr (D2.R3 R8.6)
ddr1_a10: as14120_x31_fpga_ddr (D4.B7), as14120_x31_ddr (D2.L7 R7.8)
ddr1_a11: as14120_x31_fpga_ddr (D4.A8), as14120_x31_ddr (D2.R7 R12.6)
ddr1_a12: as14120_x31_fpga_ddr (D4.B6), as14120_x31_ddr (D2.N7 R7.6)
ddr1_a13: as14120_x31_fpga_ddr (D4.A6), as14120_x31_ddr (D2.T3 R10.7)
ddr1_a14: as14120_x31_fpga_ddr (D4.E11), as14120_x31_ddr (D2.T7 R8.7)
ddr1_ba0: as14120_x31_fpga_ddr (D4.A10), as14120_x31_ddr (D2.M2 R5.6)
ddr1_ba1: as14120_x31_fpga_ddr (D4.F15), as14120_x31_ddr (D2.N8 R7.5)
ddr1_ba2: as14120_x31_fpga_ddr (D4.E15), as14120_x31_ddr (D2.M3 R5.8)
ddr1_cas: as14120_x31_fpga_ddr (D4.C9), as14120_x31_ddr (D2.K3 R5.5)
ddr1_ck_n: as14120_x31_fpga_ddr (D4.M8), as14120_x31_ddr (D2.K7 R2.6)
ddr1_ck_p: as14120_x31_fpga_ddr (D4.M9), as14120_x31_ddr (D2.J7 R2.5)
ddr1_cke: as14120_x31_fpga_ddr (D4.A18), as14120_x31_ddr (D2.K9 R16.2)
ddr1_cs: as14120_x31_fpga_ddr (D4.J15), as14120_x31_ddr (D2.L2 R2.8)
ddr1_dm0: as14120_x31_fpga_ddr (D4.B14), as14120_x31_ddr (D2.E7)
ddr1_dm1: as14120_x31_fpga_ddr (D4.B19), as14120_x31_ddr (D2.D3)
ddr1_dq0: as14120_x31_fpga_ddr (D4.C15), as14120_x31_ddr (D2.E3)
ddr1_dq1: as14120_x31_fpga_ddr (D4.C16), as14120_x31_ddr (D2.F7)
ddr1_dq2: as14120_x31_fpga_ddr (D4.C11), as14120_x31_ddr (D2.F2)
ddr1_dq3: as14120_x31_fpga_ddr (D4.A13), as14120_x31_ddr (D2.F8)
ddr1_dq4: as14120_x31_fpga_ddr (D4.D17), as14120_x31_ddr (D2.H3)
ddr1_dq5: as14120_x31_fpga_ddr (D4.E17), as14120_x31_ddr (D2.H8)
ddr1_dq6: as14120_x31_fpga_ddr (D4.D12), as14120_x31_ddr (D2.G2)
ddr1_dq7: as14120_x31_fpga_ddr (D4.A14), as14120_x31_ddr (D2.H7)
ddr1_dq8: as14120_x31_fpga_ddr (D4.B17), as14120_x31_ddr (D2.D7)
ddr1_dq9: as14120_x31_fpga_ddr (D4.C17), as14120_x31_ddr (D2.C3)
ddr1_dq10: as14120_x31_fpga_ddr (D4.A16), as14120_x31_ddr (D2.C8)
ddr1_dq11: as14120_x31_fpga_ddr (D4.C14), as14120_x31_ddr (D2.C2)
ddr1_dq12: as14120_x31_fpga_ddr (D4.F18), as14120_x31_ddr (D2.A7)
ddr1_dq13: as14120_x31_fpga_ddr (D4.G18), as14120_x31_ddr (D2.A2)
ddr1_dq14: as14120_x31_fpga_ddr (D4.B18), as14120_x31_ddr (D2.B8)
ddr1_dq15: as14120_x31_fpga_ddr (D4.A19), as14120_x31_ddr (D2.A3)
ddr1_dqs0_n: as14120_x31_fpga_ddr (D4.J17), as14120_x31_ddr (D2.G3)
ddr1_dqs0_p: as14120_x31_fpga_ddr (D4.K17), as14120_x31_ddr (D2.F3)
ddr1_dqs1_n: as14120_x31_fpga_ddr (D4.L16), as14120_x31_ddr (D2.B7)
ddr1_dqs1_p: as14120_x31_fpga_ddr (D4.K16), as14120_x31_ddr (D2.C7)
ddr1_odt: as14120_x31_fpga_ddr (D4.B13), as14120_x31_ddr (D2.K1)
ddr1_ras: as14120_x31_fpga_ddr (D4.B8), as14120_x31_ddr (D2.J3 R2.7)
ddr1_reset_n: as14120_x31_fpga_ddr (D4.B22), as14120_x31_ddr (D2.T2 R18.2)
ddr1_we: as14120_x31_fpga_ddr (D4.C7), as14120_x31_ddr (D2.L3 R5.7)
Fpga_CONF_DONE: as14120_x31_usb (D10.D3), as14120_x31_fpga_power_conf (D4.L8 R31.2)
Fpga_Data0: as14120_x31_usb (D10.D5), as14120_x31_fpga_power_conf (D4.AG5)
Fpga_DCLK: as14120_x31_usb (D10.D4), as14120_x31_fpga_power_conf (D4.T7 R32.2)
Fpga_nCONFIG: as14120_x31_usb (D10.C1), as14120_x31_fpga_power_conf (D4.C5 R30.2)
Fpga_nSTATUS: as14120_x31_usb (D10.D2), as14120_x31_fpga_power_conf (D4.K7)
ttl_rx: as14120_x31_fpga_ttl (D5.1), as14120_x31_fpga_cypress (D4.Y23)
ttl_tx: as14120_x31_fpga_ttl (D5.4), as14120_x31_fpga_cypress (D4.Y25)
ttl_tx_en: as14120_x31_fpga_ttl (D5.2 D5.3), as14120_x31_fpga_cypress (D4.AA24)
v1p5d: as14120_x31_fpga_power_conf (59 pins), as14120_x31_ddr (79 pins)
v1p8d: as14120_x31_usb (22 pins), as14120_x31_fpga_power_conf (L5.2), as14120_x31_adc (6 pins)
v3p3d: as14120_x31_usb (15 pins), as14120_x31_fpga_ttl (D5.8 R34.2 X2.5 X2.7), as14120_x31_adc (8 pins)
vRefDDR0: as14120_x31_fpga_power_conf (C118.2 C119.2 D4.AH16 D4.AJ13), as14120_x31_ddr (35 pins)
vRefDDR1: as14120_x31_fpga_power_conf (C120.2 C121.2 D4.B9 D4.B16), as14120_x31_ddr (35 pins)